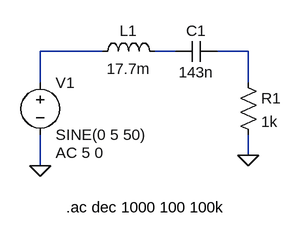
[diagram p0: schematic rlcbandpass.asc]
rlcbandpass.asc, the LTspice schematic file:
Version 4.1
SHEET 1 880 680
WIRE 160 112 64 112
WIRE 272 112 240 112
WIRE 384 112 336 112
WIRE 64 160 64 112
WIRE 384 160 384 112
WIRE 384 272 384 240
WIRE 64 288 64 240
FLAG 64 288 0
FLAG 384 272 0
SYMBOL voltage 64 144 R0
WINDOW 123 24 124 Left 2
WINDOW 39 0 0 Left 0
SYMATTR InstName V1
SYMATTR Value SINE(0 5 50)
SYMATTR Value2 AC 5 0
SYMBOL ind 144 128 R270
WINDOW 0 32 56 VTop 2
WINDOW 3 5 56 VBottom 2
SYMATTR InstName L1
SYMATTR Value 17.7m
SYMATTR SpiceLine Rser=1m
SYMBOL cap 336 96 R90
WINDOW 0 0 32 VBottom 2
WINDOW 3 32 32 VTop 2
SYMATTR InstName C1
SYMATTR Value 143n
SYMBOL res 368 144 R0
SYMATTR InstName R1
SYMATTR Value 1k
TEXT 104 352 Left 2 !.ac dec 1000 100 100k

The netlist it stands for:
* rlcbandpass.asc
V1 N001 0 SINE(0 5 50) AC 5 0
L1 N001 N002 17.7m Rser=1m
C1 N003 N002 143n
R1 N003 0 1k
.ac dec 1000 100 100k
.backanno
.end